# EAGLE design amp_tda2030_2ch_otl (EAGLE 9.6.2)
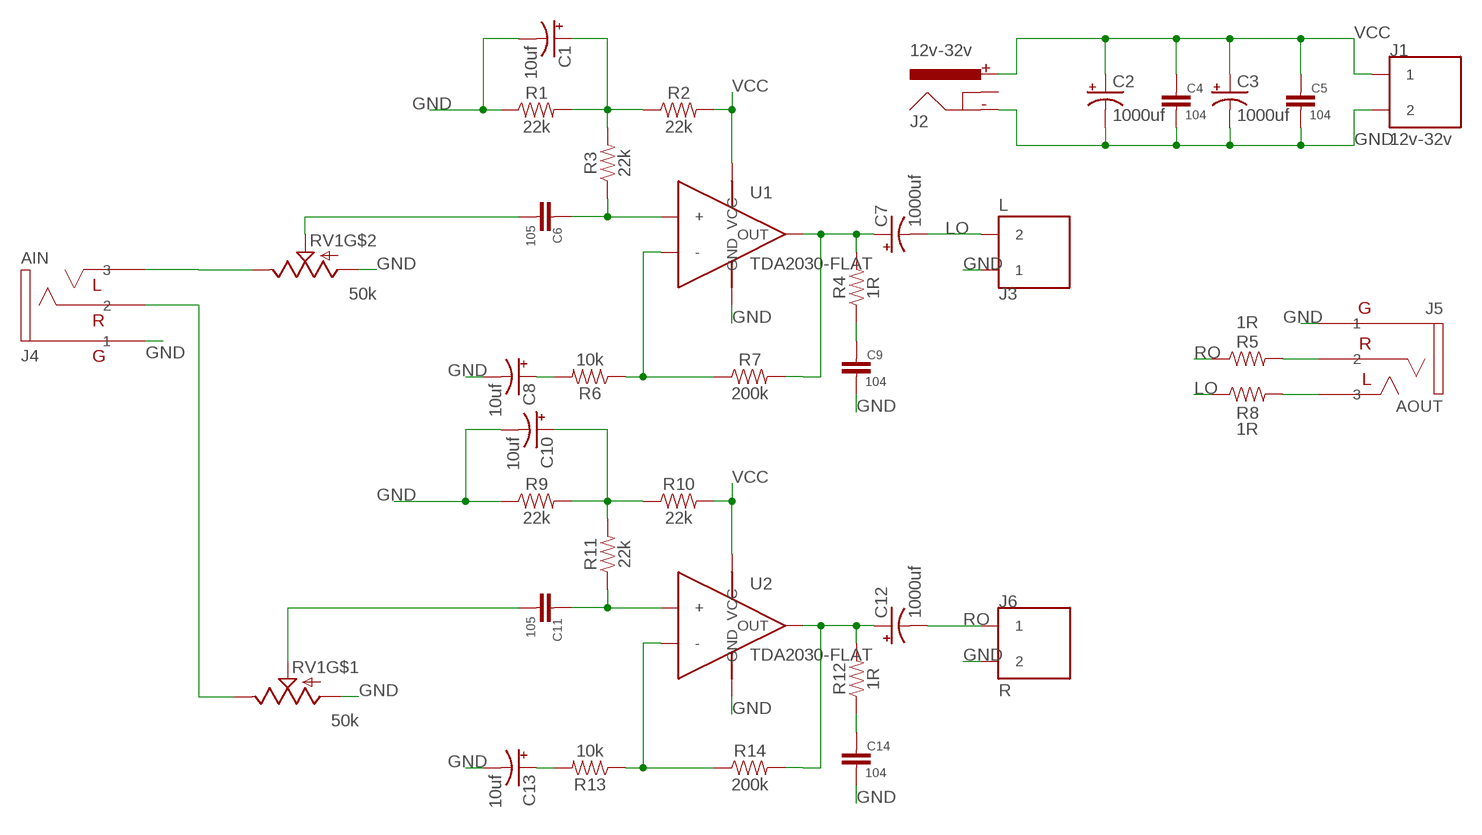
[diagram p0: schematic, sheet 1]

## Parts
C1  10uf  CAP  [CAP_2.5MM]
C2  1000uf  CAP5MM  [CAP_5MM_10D]
C3  1000uf  CAP5MM  [CAP_5MM_10D]
C4  104  CAP_P  [CAP_5MM]
C5  104  CAP_P  [CAP_5MM]
C6  105  CAP_P  [CAP_5MM]
C7  1000uf  CAP5MM  [CAP_5MM_10D]
C8  10uf  CAP  [CAP_2.5MM]
C9  104  CAP_P  [CAP_5MM]
C10  10uf  CAP  [CAP_2.5MM]
C11  105  CAP_P  [CAP_5MM]
C12  1000uf  CAP5MM  [CAP_5MM_10D]
C13  10uf  CAP  [CAP_2.5MM]
C14  104  CAP_P  [CAP_5MM]
J1  12v-32v  2P5.0  [2P_5.08MM]
J2  12v-32v  POWER_JACKPTH_LOCK  [POWER_JACK_PTH_LOCK]
J3  L  2P5.0  [2P_5.08MM]
J4  AIN  3.5MM_PHONE  [3.5MM]
J5  AOUT  3.5MM_PHONE  [3.5MM]
J6  R  2P5.0  [2P_5.08MM]
R1  22k  RESISTORAXIAL-0.3  [AXIAL-0.3]
R2  22k  RESISTORAXIAL-0.3  [AXIAL-0.3]
R3  22k  RESISTORAXIAL-0.3  [AXIAL-0.3]
R4  1R  RESISTORAXIAL-0.3  [AXIAL-0.3]
R5  1R  RES_P  [2WS]
R6  10k  RESISTORAXIAL-0.3  [AXIAL-0.3]
R7  200k  RESISTORAXIAL-0.3  [AXIAL-0.3]
R8  1R  RES_P  [2WS]
R9  22k  RESISTORAXIAL-0.3  [AXIAL-0.3]
R10  22k  RESISTORAXIAL-0.3  [AXIAL-0.3]
R11  22k  RESISTORAXIAL-0.3  [AXIAL-0.3]
R12  1R  RESISTORAXIAL-0.3  [AXIAL-0.3]
R13  10k  RESISTORAXIAL-0.3  [AXIAL-0.3]
R14  200k  RESISTORAXIAL-0.3  [AXIAL-0.3]
RV1  50k  POT_DUALPOT_DUAL_GREEN  [POT_DUAL_GREEN]
U1  TDA2030-FLAT  [TO220-FLAT]
U2  TDA2030-FLAT  [TO220-FLAT]

## Nets
GND: C1.- C2.- C3.- C4.P$2 C5.P$2 C8.- C9.P$2 C10.- C13.- C14.P$2 J1.N J2.GND J3.L J4.P$1 J5.P$1 J6.N R1.P$1 R9.P$1 RV1.P$1(A) RV1.P$4(A) U1.3(GND) U1.TAB(GND) U2.3(GND) U2.TAB(GND)
LO: C7.- J3.N R8.P$1
N$1: C6.P$1 R3.P$1 U1.1(+)
N$3: C6.P$2 RV1.P$5(S)
N$4: C11.P$2 RV1.P$2(S)
N$5: C1.+ R1.P$2 R2.P$1 R3.P$2
N$6: C8.+ R6.P$2
N$7: R6.P$1 R7.P$1 U1.2(-)
N$8: J4.P$3 RV1.P$6(E)
N$9: J4.P$2 RV1.P$3(E)
N$11: C11.P$1 R11.P$1 U2.1(+)
N$12: C7.+ R4.P$2 R7.P$2 U1.4(OUT)
N$13: J5.P$2 R5.P$2
N$14: C9.P$1 R4.P$1
N$15: C10.+ R9.P$2 R10.P$1 R11.P$2
N$16: C13.+ R13.P$2
N$17: R13.P$1 R14.P$1 U2.2(-)
N$18: C12.+ R12.P$2 R14.P$2 U2.4(OUT)
N$19: C14.P$1 R12.P$1
N$21: J5.P$3 R8.P$2
RO: C12.- J6.L R5.P$1
VCC: C2.+ C3.+ C4.P$1 C5.P$1 J1.L J2.PWR R2.P$2 R10.P$2 U1.5(VCC) U2.5(VCC)
Unconnected: J2.GNDBREAK

## Library data of the parts
C1-C3 C7 C8 C10 C12 C13 = Capacitors:CAP
C4-C6 C9 C11 C14 = Capacitors:CAP_P
J1 J3 J6 = Jumpers:2P
J2 = Connectors:POWER_JACK: Power Jack Connector This is the standard 5.5mm barrel jack for power. The PTH is the most common, proven, reliable, footprint. The Slot footprint only works if the mill layer is transmitted to the PCB fab house so be warned. Here are the connectors we sell at SparkFun: DC Barrel Power Jack/Connector <https://www.sparkfun.com/products/119> (PRT-00119) DC Barrel Power Jack/Connector (SMD) <https://www.sparkfun.com/products/12748> (PRT-12748) DC Barrel Jack Adapter - Breadboard Compatible <https://www.sparkfun.com/products/10811> (PRT-10811) It is used on this SparkFun product (and many, many others): SparkFun RedBoard - Programmed with Arduino <https://www.sparkfun.com/products/12757> (DEV-12757) Also, if you need a mating power supply or connector, please check these out: Wall Adapter Power Supply - 9VDC 650mA <https://www.sparkfun.com/products/298> (TOL-00298) DC Barrel Jack Adapter - Male <https://www.sparkfun.com/products/10287> (PRT-10287); PROD_ID: CONN-08197; SF_ID: PRT-00119
J4 J5 = Connectors:3.5MM_PHONE: 描述： 类型：3.5mm耳机插口 接口：三段式 连接：https://item.szlcsc.com/19296.html
R1-R4 R6 R7 R9-R14 = PTH:RESISTOR: Generic Resistor Package
R5 R8 = Resistors:RES_P: 描述： 类型：电阻 精度：1% 参数：100k 链接：https://item.szlcsc.com/58973.html
RV1 = xmgu2008:POT_DUAL
U1 U2 = IC-Amplifiers:TDA2030: 描述： 类型：音频功率放大器 型号：TDA2030L-TB5-T 电压：±6V ~ 18V 功率：11W x 1 @ 8Ω 封装：TO-220B 温度:-40~85 连接：https://item.szlcsc.com/83273.html

## Board
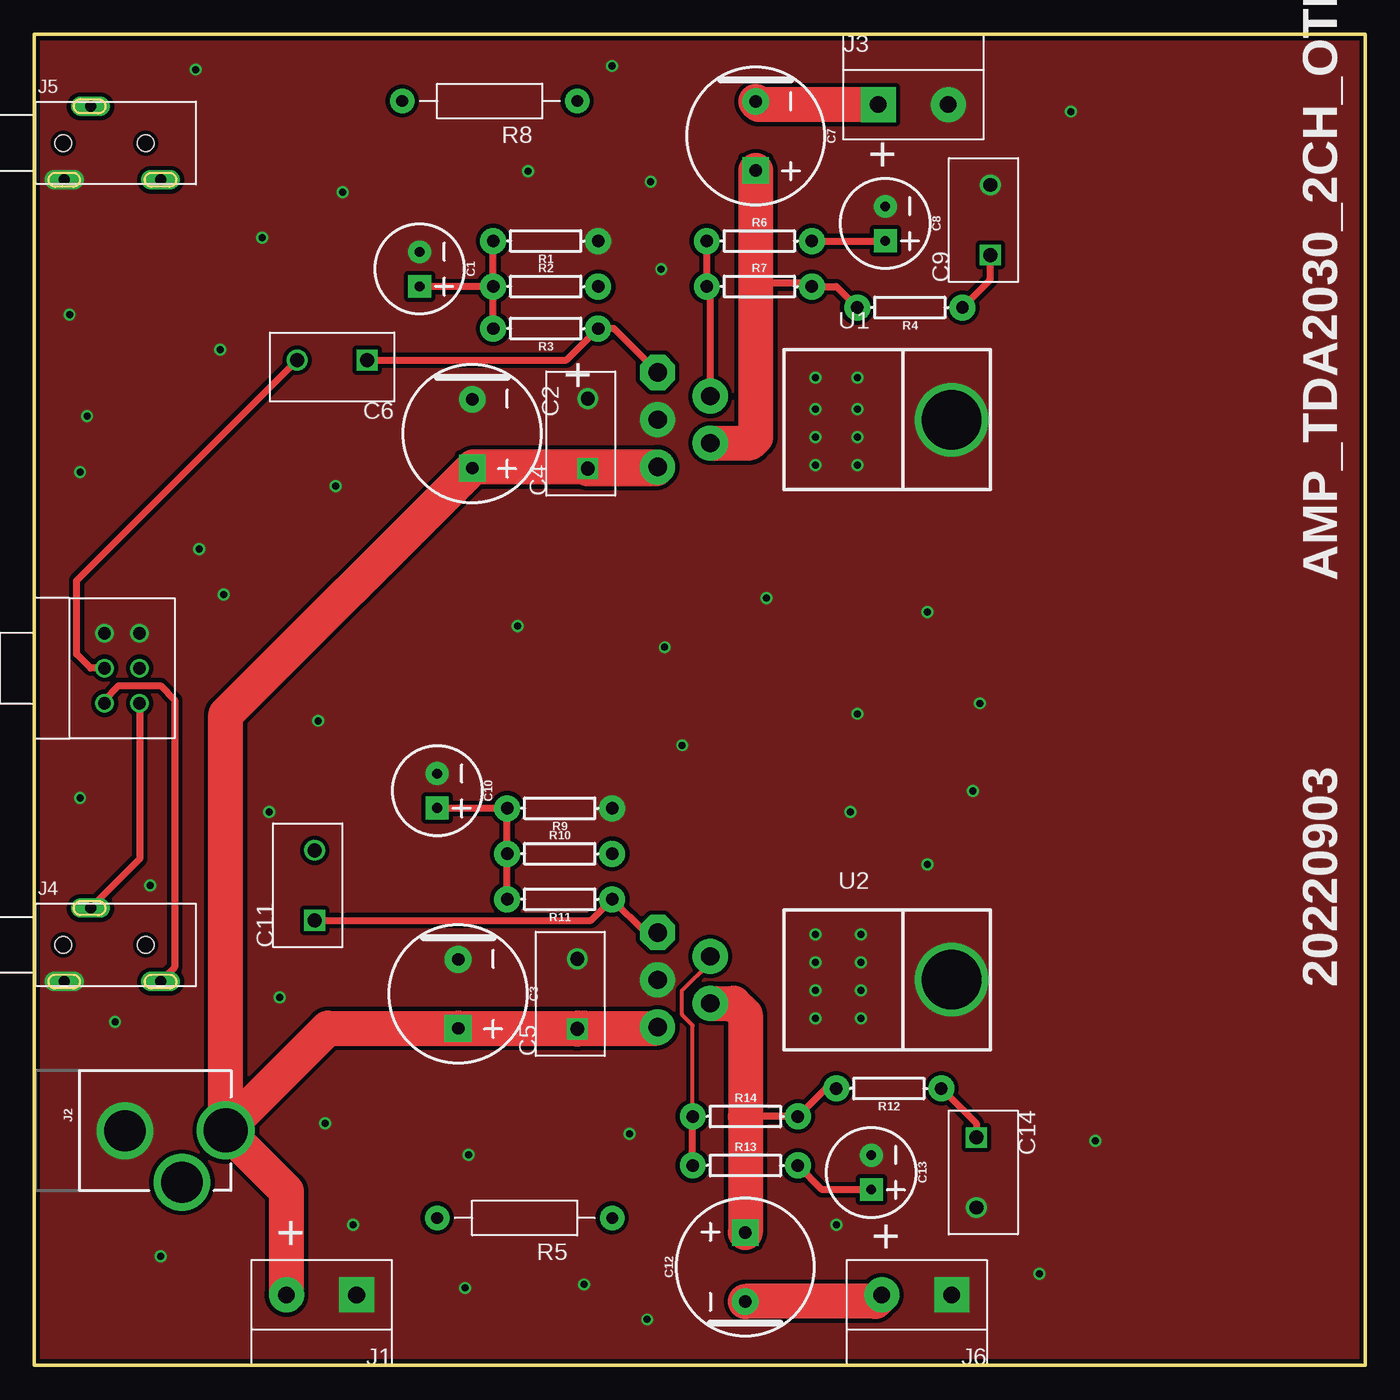
[diagram p1: board, top side]
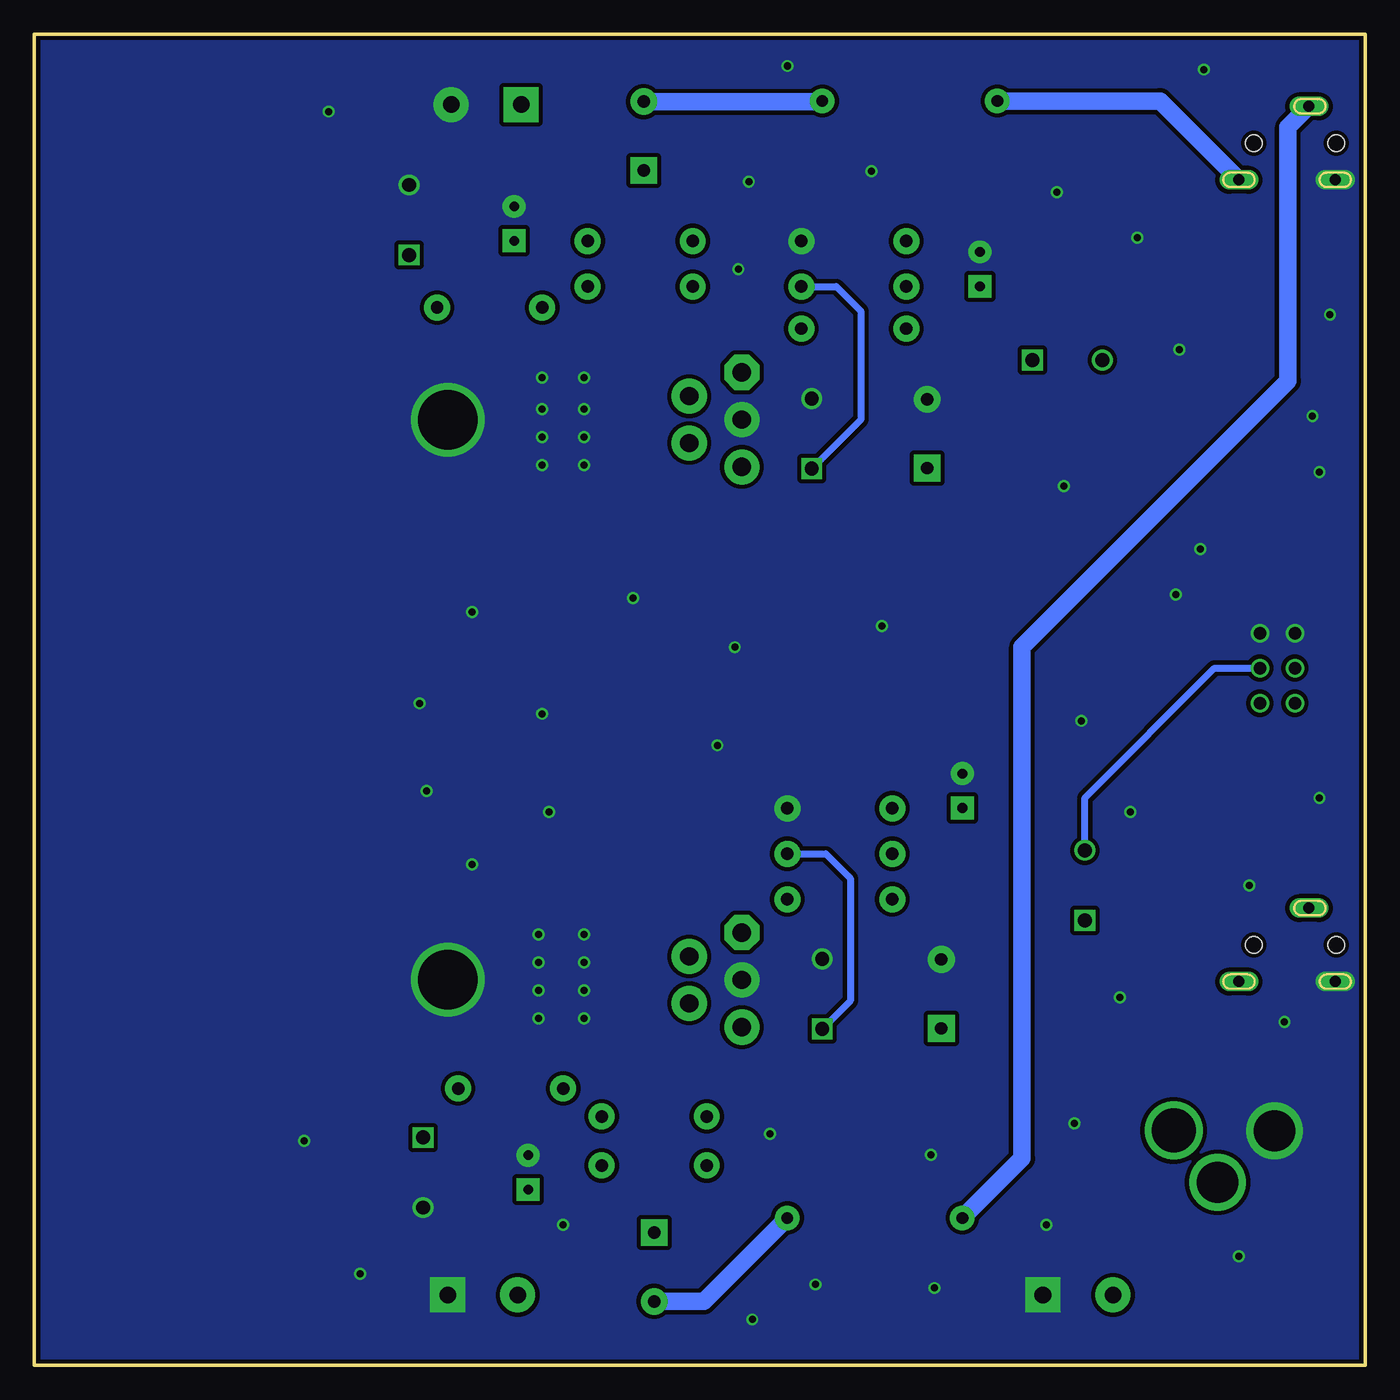
[diagram p2: board, bottom side, seen from below]

Size 96.52 x 96.52 mm. Coordinates in mm from the lower left corner, seen from the top.
Outline: 0,0 0,96.52 96.52,96.52 96.52,0 0,0
Copper layers (1*16): Top 0.035mm / dielectric 1.5mm / Bottom 0.035mm
Design rules "SparkFun-2-Layer-General-JLCPCB": minimum track width 7mil, minimum drill 0.3mm, track to track 7mil, track to pad 7mil, pad to pad 7mil, via to via 7mil, smd to smd 7mil, copper to edge 7mil, drill to drill 7mil, minimum pad ring 7mil, minimum via ring 7mil, stop-mask expansion 3mil, vias tented up to drill 25mil, thermal gap 10mil

### Footprints (pad centres in the part's own frame; a part is rotated, then mirrored left to right if it is on the bottom)
CAP_2.5MM = drill 0.7 pad 1.651 square: + 1.25,0 | drill 0.7 pad 1.651: - -1.25,0
CAP_5MM_10D = drill 0.9 pad 1.93 square: + 2.5,0 | drill 0.9 pad 1.93: - -2.5,0
CAP_5MM = drill 1 square: P$1 -2.54,0 | drill 1: P$2 2.54,0
2P_5.08MM = drill 1.2 pad 2.54: L 5.08,0 | drill 1.2 pad 2.54 square: N 0,0
POWER_JACK_PTH_LOCK = drill 2.997 pad 4.115: GND 0.025,6.557; GNDBREAK 3.762,10.7 | drill 3.2 pad 4.115: PWR 0,13.878
3.5MM = drill 0.8 pad 1.422 long: P$1 -2.921,-2.667; P$2 -1.016,2.667; P$3 4.064,-2.667 | hole 1.2: -3,0; 3,0
AXIAL-0.3 = drill 0.9 pad 1.88: P$1 -3.81,0; P$2 3.81,0
2WS = drill 0.85 pad 1.778: P$1 0,0; P$2 12.7,0
POT_DUAL_GREEN = drill 0.9: P$1 -2.54,2.54; P$2 0,2.54; P$3 2.54,2.54; P$4 -2.54,0; P$5 0,0; P$6 2.54,0
TO220-FLAT = drill 1.321 pad 2.54 octagon: 1 -3.429,-3.556 | drill 1.321 pad 2.54: 2 -1.702,0.254; 3 0,-3.556; 4 1.702,0.254; 5 3.429,-3.556 | drill 4.318: TAB 0,17.78

### Placement (x,y rotation side)
C1  27.94,79.5 270 top
C2  31.75,67.56 270 top
C3  30.73,26.92 270 top
C4  40.13,67.56 90 top
C5  39.37,26.92 90 top
C6  21.59,72.9 180 top
C7  52.32,89.15 270 top
C8  61.72,82.8 270 top
C9  69.34,83.06 90 top
C10  29.21,41.66 270 top
C11  20.32,34.8 90 top
C12  51.56,7.11 90 top
C13  60.71,13.97 270 top
C14  68.33,13.97 270 top
J1  23.37,5.08 180 top
J2  0,17.02 270 top
J3  61.21,91.44 0 top
J4  5.08,30.48 0 top
J5  5.08,88.65 0 top
J6  66.55,5.08 180 top
R1  37.08,81.53 180 top
R2  37.08,78.23 0 top
R3  37.08,75.18 180 top
R4  63.5,76.71 180 top
R5  41.91,10.67 180 top
R6  52.58,81.53 0 top
R7  52.58,78.23 0 top
R8  39.37,91.69 180 top
R9  38.1,40.39 180 top
R10  38.1,37.08 0 top
R11  38.1,33.78 180 top
R12  61.98,20.07 180 top
R13  51.56,14.48 0 top
R14  51.56,18.03 0 top
RV1  5.08,50.55 270 top
U1  48.77,68.58 270 top
U2  48.77,27.94 270 top

### Tracks (layer width: path | path; a pad name or v marks a point on that pad's centre or on a via)
GND  (via drill 0.51)
  other vias: 59.69,47.24 45.72,52.07 35.05,53.59 46.99,44.96 59.18,40.13 53.09,55.63 64.77,54.61 68.58,48.01 68.07,41.66 64.77,36.32 56.64,31.24 59.94,31.24 56.64,29.21 59.94,29.21 56.64,27.18 59.94,27.18 56.64,71.63 59.69,71.63 59.69,69.34 59.69,67.31 59.69,65.28 56.64,65.28 56.64,67.31 56.64,69.34 56.64,25.15 59.94,25.15 21.84,63.75 13.46,73.66 16.51,81.79 22.35,85.09 11.68,93.98 35.81,86.61 41.91,94.23 44.7,85.85 75.18,90.93 45.47,79.5 2.54,76.2 3.81,68.83 3.3,64.77 11.94,59.18 13.72,55.88 20.57,46.74 17.02,40.13 3.3,41.15 8.38,34.8 5.84,24.89 17.78,26.67 21.08,17.53 9.14,7.87 23.11,10.16 31.5,15.24 31.24,5.59 39.88,5.84 43.18,16.76 58.17,10.16 72.9,6.6 76.96,16.26 44.45,3.3
  pour Top (isolate 0.305, no thermals): 0,0 0,96.52 96.52,96.52 96.52,0
  pour Bottom (isolate 0.305, no thermals): 0,0 0,96.52 96.52,96.52 96.52,0
LO
  Top 2.54: J3.N 52.54,91.44 C7.-
  Bottom 1.27: C7.- 39.41,91.65 R8.P$1
N$1
  Top 0.508: U1.1 42.04,75.18 R3.P$1 38.61,72.9 C6.P$1
N$3
  Top 0.508: RV1.P$5 4.06,50.55 3.05,51.56 3.05,56.9 C6.P$2
N$4
  Bottom 0.508: C11.P$2 20.32,41.15 10.92,50.55 RV1.P$2
N$5
  Top 0.508: R3.P$2 R2.P$1 | R2.P$1 R1.P$2 | R2.P$1 27.96,78.23 C1.+
N$6
  Top 0.508: R6.P$2 61.7,81.53 C8.+
N$7
  Top 0.508: U1.2 49.02,77.98 R7.P$1 R6.P$1
N$8
  Top 0.508: RV1.P$6 5.08,48.26 6.1,49.28 9.14,49.28 10.16,48.26 10.16,28.83 J4.P$3
N$9
  Top 0.508: RV1.P$3 7.62,36.7 J4.P$2
N$11
  Top 0.508: C11.P$1 40.39,32.26 R11.P$1 44.32,31.37 U2.1
N$12
  Top 0.508: 52.32,78.49 56.13,78.49 R7.P$2 58.17,78.23 R4.P$2
  Top 2.54: U1.4 51.89,66.88 52.32,67.31 52.32,78.49 52.32,81.79 C7.+
N$13
  Bottom 1.27: R5.P$2 24.89,14.99 24.89,52.07 5.59,71.37 5.59,89.79 J5.P$2
N$14
  Top 0.508: R4.P$1 69.34,78.74 C9.P$1
N$15
  Top 0.508: R11.P$2 R10.P$1 R9.P$2 29.23,40.39 C10.+
N$16
  Top 0.508: C13.+ 57.13,12.72 R13.P$2
N$17
  Top 0.305: R14.P$1 47.75,24.64 46.99,25.4 46.99,27.18 49.02,29.21 U2.2
  Top 0.508: R13.P$1 R14.P$1
N$18
  Top 0.508: 51.56,18.03 R14.P$2 57.4,20.07 | 57.4,20.07 57.66,20.07 | 57.66,20.07 R12.P$2 | 57.4,20.07 57.66,20.07
  Top 2.54: U2.4 50.72,26.24 51.56,25.4 51.56,18.03 C12.+
N$19
  Top 0.508: R12.P$1 68.33,17.53 C14.P$1
N$21
  Bottom 1.27: R8.P$2 14.86,91.69 J5.P$3
RO
  Top 2.54: J6.L 61,4.61 C12.-
  Bottom 1.27: C12.- 47.97,4.61 R5.P$1
VCC
  Top 2.54: 31.84,65.15 U1.5 45.09,65.02 C4.P$1 | 31.84,65.15 C2.+ | 39.88,24.42 C3.+ 21.28,24.42 J2.PWR | 39.88,24.42 45.12,24.42 U2.5 | C5.P$1 39.41,24.42 39.88,24.42 | J1.L 18.29,12.61 J2.PWR | J2.PWR 13.88,47.19 31.84,65.15
  Bottom 0.508: R2.P$2 38.35,78.23 36.58,76.45 36.58,68.58 C4.P$1 | R10.P$2 39.12,37.08 37.34,35.31 37.34,26.42 C5.P$1

### Text on the board
tPlace: + | + | AMP_TDA2030_2CH_OTL | 20220903 | + | +